# Altium schematic sheet MCU.SchDoc
size A4
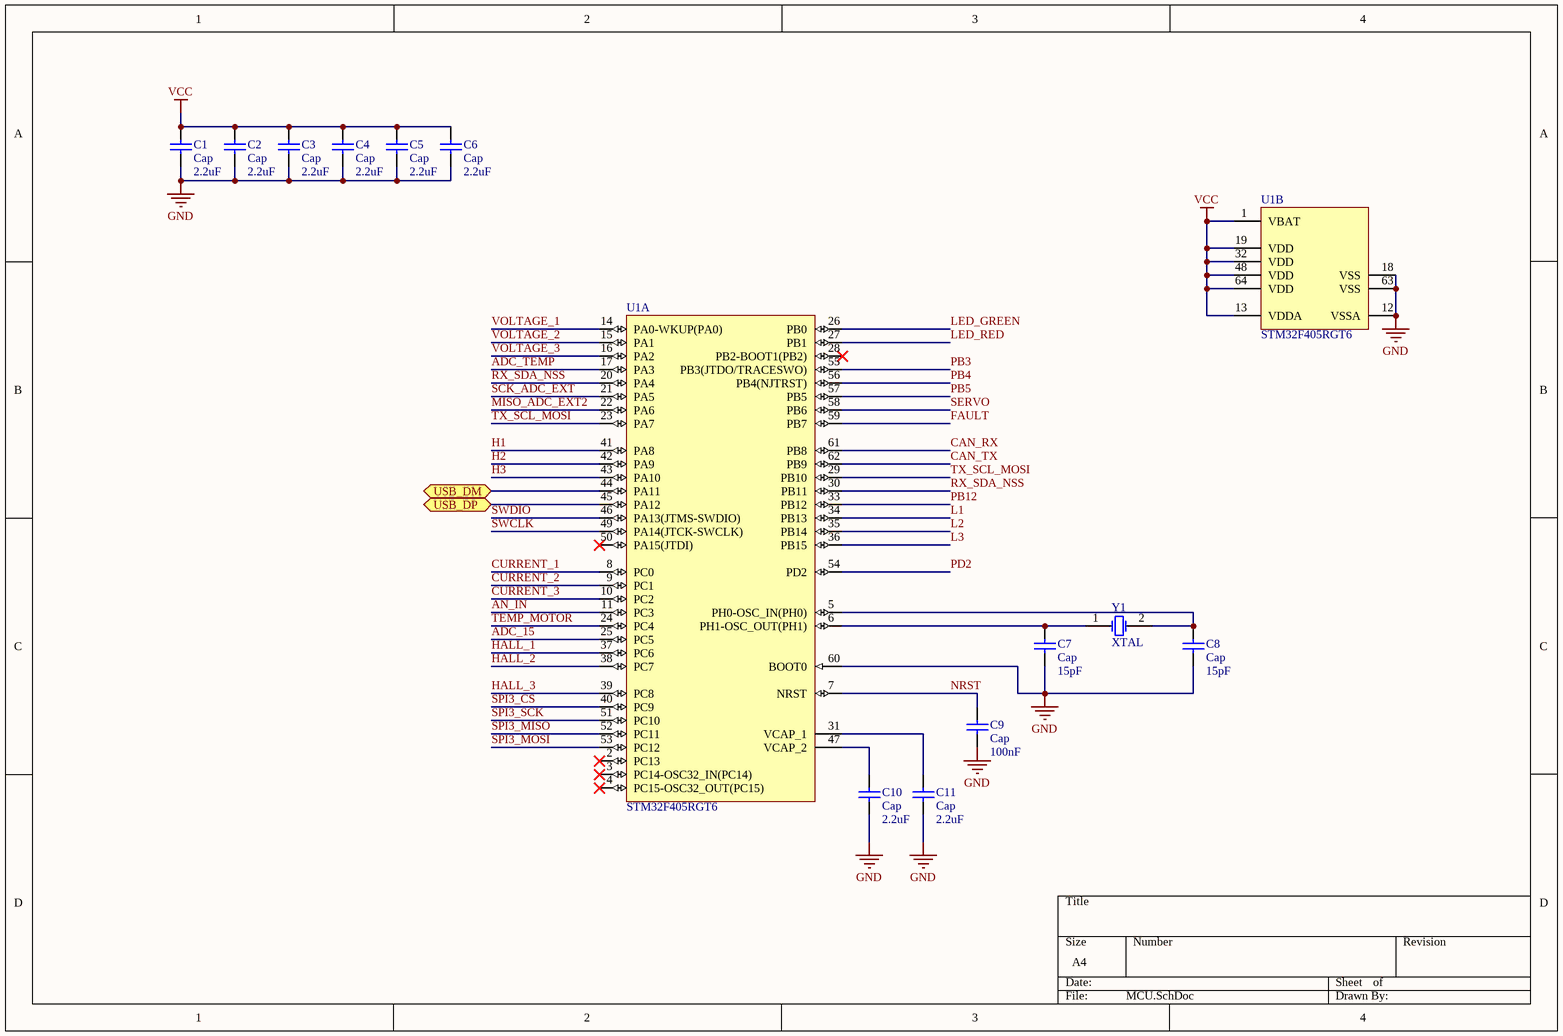
[diagram p0: MCU.SchDoc]

## Parts
C1  Cap  value 2.2uF  [RAD-0.3]
C2  Cap  value 2.2uF  [RAD-0.3]
C3  Cap  value 2.2uF  [RAD-0.3]
C4  Cap  value 2.2uF  [RAD-0.3]
C5  Cap  value 2.2uF  [RAD-0.3]
C6  Cap  value 2.2uF  [RAD-0.3]
C7  Cap  value 15pF  [RAD-0.3]
C8  Cap  value 15pF  [RAD-0.3]
C9  Cap  value 100nF  [RAD-0.3]
C10  Cap  value 2.2uF  [RAD-0.3]
C11  Cap  value 2.2uF  [RAD-0.3]
U1  STM32F405RGT6  [STM-LQFP64_M]  (parts A,B of 2)
Y1  XTAL  [R38]

## Ports
USB_DM (bidir), USB_DP (bidir)

## Nets
GND: C1.1 C2.1 C3.1 C4.1 C5.1 C6.1 C7.1 C8.1 C9.1 C10.1 C11.1 U1.12(VSSA) U1.18(VSS) U1.60(BOOT0) U1.63(VSS)
VCC: C1.2 C2.2 C3.2 C4.2 C5.2 C6.2 U1.1(VBAT) U1.13(VDDA) U1.19(VDD) U1.32(VDD) U1.48(VDD) U1.64(VDD)
ADC_15: U1.25(PC5)
ADC_TEMP: U1.17(PA3)
AN_IN: U1.11(PC3)
CAN_RX: U1.61(PB8)
CAN_TX: U1.62(PB9)
CURRENT_1: U1.8(PC0)
CURRENT_2: U1.9(PC1)
CURRENT_3: U1.10(PC2)
FAULT: U1.59(PB7)
H1: U1.41(PA8)
H2: U1.42(PA9)
H3: U1.43(PA10)
HALL_1: U1.37(PC6)
HALL_2: U1.38(PC7)
HALL_3: U1.39(PC8)
L1: U1.34(PB13)
L2: U1.35(PB14)
L3: U1.36(PB15)
LED_GREEN: U1.26(PB0)
LED_RED: U1.27(PB1)
MISO_ADC_EXT2: U1.22(PA6)
NRST: C9.2 U1.7(NRST)
PB3: U1.55(PB3(JTDO/TRACESWO))
PB4: U1.56(PB4(NJTRST))
PB5: U1.57(PB5)
PB12: U1.33(PB12)
PD2: U1.54(PD2)
RX_SDA_NSS: U1.20(PA4) U1.30(PB11)
SCK_ADC_EXT: U1.21(PA5)
SERVO: U1.58(PB6)
SPI3_CS: U1.40(PC9)
SPI3_MISO: U1.52(PC11)
SPI3_MOSI: U1.53(PC12)
SPI3_SCK: U1.51(PC10)
SWCLK: U1.49(PA14(JTCK-SWCLK))
SWDIO: U1.46(PA13(JTMS-SWDIO))
TEMP_MOTOR: U1.24(PC4)
TX_SCL_MOSI: U1.23(PA7) U1.29(PB10)
USB_DM: U1.44(PA11) ; port USB_DM
USB_DP: U1.45(PA12) ; port USB_DP
VOLTAGE_1: U1.14(PA0-WKUP(PA0))
VOLTAGE_2: U1.15(PA1)
VOLTAGE_3: U1.16(PA2)
NetC7_2: C7.2 U1.6(PH1-OSC_OUT(PH1)) Y1.1(OSC1)
NetC8_2: C8.2 U1.5(PH0-OSC_IN(PH0)) Y1.2(OSC2)
NetC10_2: C10.2 U1.47(VCAP_2)
NetC11_2: C11.2 U1.31(VCAP_1)

Not connected (* = marked no-connect by the designer): U1 2(PC13)* 3(PC14-OSC32_IN(PC14))* 4(PC15-OSC32_OUT(PC15))* 28(PB2-BOOT1(PB2))* 50(PA15(JTDI))*

## Library data of the parts
C1-C11 = Cap: Capacitor; Published: 8-Jun-2000; LatestRevisionDate: 17-Jul-2002; LatestRevisionNote: Re-released for DXP Platform.; PackageReference: RAD-0.3; Publisher: Altium Limited; PackageDescription: Radial Cap, Thru-Hole; 2 Leads; 0.3 in Pin Spacing
U1 = CMP-0243-00019-3: ARM Cortex-M4 32-bit MCU+FPU, 210 DMIPS, 1024 kB Flash, 192 kB Internal RAM, 51 I/Os, 64-pin LQFP, -40 to 85 degC, Tray; Manufacturer: STMicroelectronics; Supply Voltage(Vcc) min (V): 1.8; Supply Voltage(Vcc) max (V): 3.6; Internal RAM Size (kB): 192; I/Os (High Current): 51; D/A Converter: 2x12-bit; FLASH Size (Prog) (kB): 1024; Operating Frequency(F) (Processor speed) (MHz): 168; ComponentLink2Description: Datasheet; PackageVersion: Rev. 4, 06/2013; DatasheetVersion: Rev. 4; Core: ARM Cortex-M4; ComponentLink2URL: http://www.st.com/st-web-ui/static/active/en/resource/technical/document/datasheet/DM00037051.pdf; PackageReference: LQFP64; Packing: Tray; ComponentLink1Description: Manufacturer URL; ComponentLink3URL: http://www.st.com/st-web-ui/static/active/en/resource/technical/document/datasheet/DM00037051.pdf; ComponentLink3Description: Package Specification; Mounting Technology: Surface Mount; ComponentLink1URL: http://www.st.com/web/en/home.html; PackageDescription: 64-Pin Low Profile Quad Flat Package, 10 x 10 mm Body, 0.5 mm Pitch; PartNumber: STM32F405RGT6
Y1 = XTAL: Crystal Oscillator; Published: 8-Jun-2000; LatestRevisionDate: 17-Jul-2002; LatestRevisionNote: Re-released for DXP Platform.; PackageReference: R38; Publisher: Altium Limited; PackageDescription: Crystal, Thru-Hole; 2 Leads; Body 3.1 x 8.2 mm (Dia.xH)